# Altium schematic sheet De_Embed.SchDoc
size A
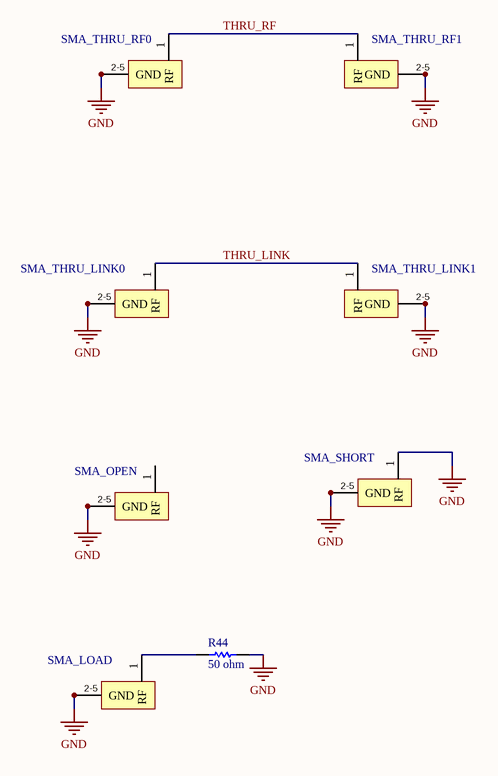
[diagram p0: De_Embed.SchDoc]

## Parts
R44  50 ohm  [RES_0402]
SMA_LOAD  CONSMA001-SMD-G  [CON-SMA-SMD]  (value not drawn)
SMA_OPEN  CONSMA001-SMD-G  [CON-SMA-SMD]  (value not drawn)
SMA_SHORT  CONSMA001-SMD-G  [CON-SMA-SMD]  (value not drawn)
SMA_THRU_LINK0  CONSMA001-SMD-G  [CON-SMA-SMD]  (value not drawn)
SMA_THRU_LINK1  CONSMA001-SMD-G  [CON-SMA-SMD]  (value not drawn)
SMA_THRU_RF0  CONSMA001-SMD-G  [CON-SMA-SMD]  (value not drawn)
SMA_THRU_RF1  CONSMA001-SMD-G  [CON-SMA-SMD]  (value not drawn)

## Nets
GND: R44.2(BOT) SMA_LOAD.2(GND) SMA_LOAD.3(GND) SMA_LOAD.4(GND) SMA_LOAD.5(GND) SMA_OPEN.2(GND) SMA_OPEN.3(GND) SMA_OPEN.4(GND) SMA_OPEN.5(GND) SMA_SHORT.1(RF) SMA_SHORT.2(GND) SMA_SHORT.3(GND) SMA_SHORT.4(GND) SMA_SHORT.5(GND) SMA_THRU_LINK0.2(GND) SMA_THRU_LINK0.3(GND) SMA_THRU_LINK0.4(GND) SMA_THRU_LINK0.5(GND) SMA_THRU_LINK1.2(GND) SMA_THRU_LINK1.3(GND) SMA_THRU_LINK1.4(GND) SMA_THRU_LINK1.5(GND) SMA_THRU_RF0.2(GND) SMA_THRU_RF0.3(GND) SMA_THRU_RF0.4(GND) SMA_THRU_RF0.5(GND) SMA_THRU_RF1.2(GND) SMA_THRU_RF1.3(GND) SMA_THRU_RF1.4(GND) SMA_THRU_RF1.5(GND)
THRU_LINK: SMA_THRU_LINK0.1(RF) SMA_THRU_LINK1.1(RF)
THRU_RF: SMA_THRU_RF0.1(RF) SMA_THRU_RF1.1(RF)
NetR44_1: R44.1(TOP) SMA_LOAD.1(RF)

Not connected (* = marked no-connect by the designer): SMA_OPEN 1(RF)

## Notes on the sheet
- (in symbol SURFACE MOUNT SMA CONNECTOR) 2-5

## Library data of the parts
R44 = res 50 ohm 0402: RES SMD 50 OHM 0.1% 1/20W 0402; Manufacturer: Vishay; Manufacturer ID: FC0402E50R0BST1; Package: 0402; Supplier 1: Digi-Key; Supplier Part Number 1: FC0402-50BWCT-ND; Resistance: 50 Ohm
SMA_LOAD SMA_OPEN SMA_SHORT SMA_THRU_LINK0 SMA_THRU_LINK1 SMA_THRU_RF0 SMA_THRU_RF1 = SURFACE MOUNT SMA CONNECTOR: SMD SMA CONNECTOR; Manufacturer 1: Linx Technologies; Supplier 1: Digi-Key; Supplier Part Number 1: CONSMA001-SMD-ND; Manufacturer Part Number 1: CONSMA001-SMD-G; Manufacturer Part Number 2: CONSMA002-SMD; Supplier Part Number 2: CONSMA002-SMD-ND